# EAGLE schematic dev-test-proto (EAGLE 7.3.0)
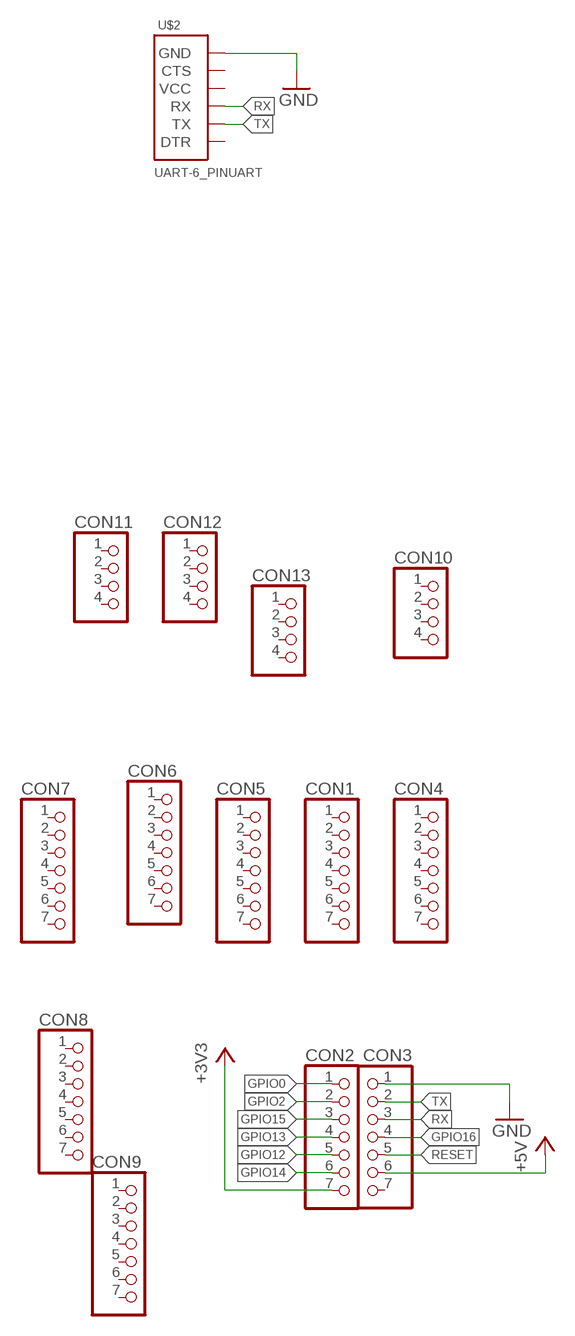
[diagram p0: schematic, sheet 1]

## Parts
CON1  GENERIC-1X7THT  [PINHEADER-100MIL-1X7]
CON2  GENERIC-1X7THT  [PINHEADER-100MIL-1X7]
CON3  GENERIC-1X7THT  [PINHEADER-100MIL-1X7]
CON4  GENERIC-1X7THT  [PINHEADER-100MIL-1X7]
CON5  GENERIC-1X7THT  [PINHEADER-100MIL-1X7]
CON6  GENERIC-1X7THT  [PINHEADER-100MIL-1X7]
CON7  GENERIC-1X7THT  [PINHEADER-100MIL-1X7]
CON8  GENERIC-1X7THT  [PINHEADER-100MIL-1X7]
CON9  GENERIC-1X7THT  [PINHEADER-100MIL-1X7]
CON10  GENERIC-1X4STRAIGHT  [PINHEADER-100MIL-1X4-NOSILK]
CON11  GENERIC-1X4STRAIGHT  [PINHEADER-100MIL-1X4-NOSILK]
CON12  GENERIC-1X4STRAIGHT  [PINHEADER-100MIL-1X4-NOSILK]
CON13  GENERIC-1X4STRAIGHT  [PINHEADER-100MIL-1X4-NOSILK]
U$2  UART-6_PINUART  [ANGLE-1X6]

## Nets
+3V3: CON2.7
+5V: CON3.6
GND: CON3.1 U$2.1(GND)
GPIO0: CON2.1
GPIO2: CON2.2
GPIO12: CON2.5
GPIO13: CON2.4
GPIO14: CON2.6
GPIO15: CON2.3
GPIO16: CON3.4
RESET: CON3.5
RX: CON3.3 U$2.4(RX)
TX: CON3.2 U$2.5(TX)
Unconnected: CON1.1 CON1.2 CON1.3 CON1.4 CON1.5 CON1.6 CON1.7 CON3.7 CON4.1 CON4.2 CON4.3 CON4.4 CON4.5 CON4.6 CON4.7 CON5.1 CON5.2 CON5.3 CON5.4 CON5.5 CON5.6 CON5.7 CON6.1 CON6.2 CON6.3 CON6.4 CON6.5 CON6.6 CON6.7 CON7.1 CON7.2 CON7.3 CON7.4 CON7.5 CON7.6 CON7.7 CON8.1 CON8.2 CON8.3 CON8.4 CON8.5 CON8.6 CON8.7 CON9.1 CON9.2 CON9.3 CON9.4 CON9.5 CON9.6 CON9.7 CON10.1 CON10.2 CON10.3 CON10.4 CON11.1 CON11.2 CON11.3 CON11.4 CON12.1 CON12.2 CON12.3 CON12.4 CON13.1 CON13.2 CON13.3 CON13.4 U$2.2(CTS) U$2.3(VCC) U$2.6(DTR)

## Library data of the parts
CON1-CON9 = p.peter-connectors:GENERIC-1X7
CON10-CON13 = p.peter-connectors:GENERIC-1X4
U$2 = p.peter-connectors:UART-6_PIN: RX and TX direction as seen from outside. I.e. connect RX from connector to RX from Atmega